# EasyEDA schematic 234trw_2020-09-26_01-09-06.json
TITLE: Sheet_1; REV: 1.0; Date: 2020-09-25; Sheet: 1/1; Drawn By: Christian Williams; Company: Your Company
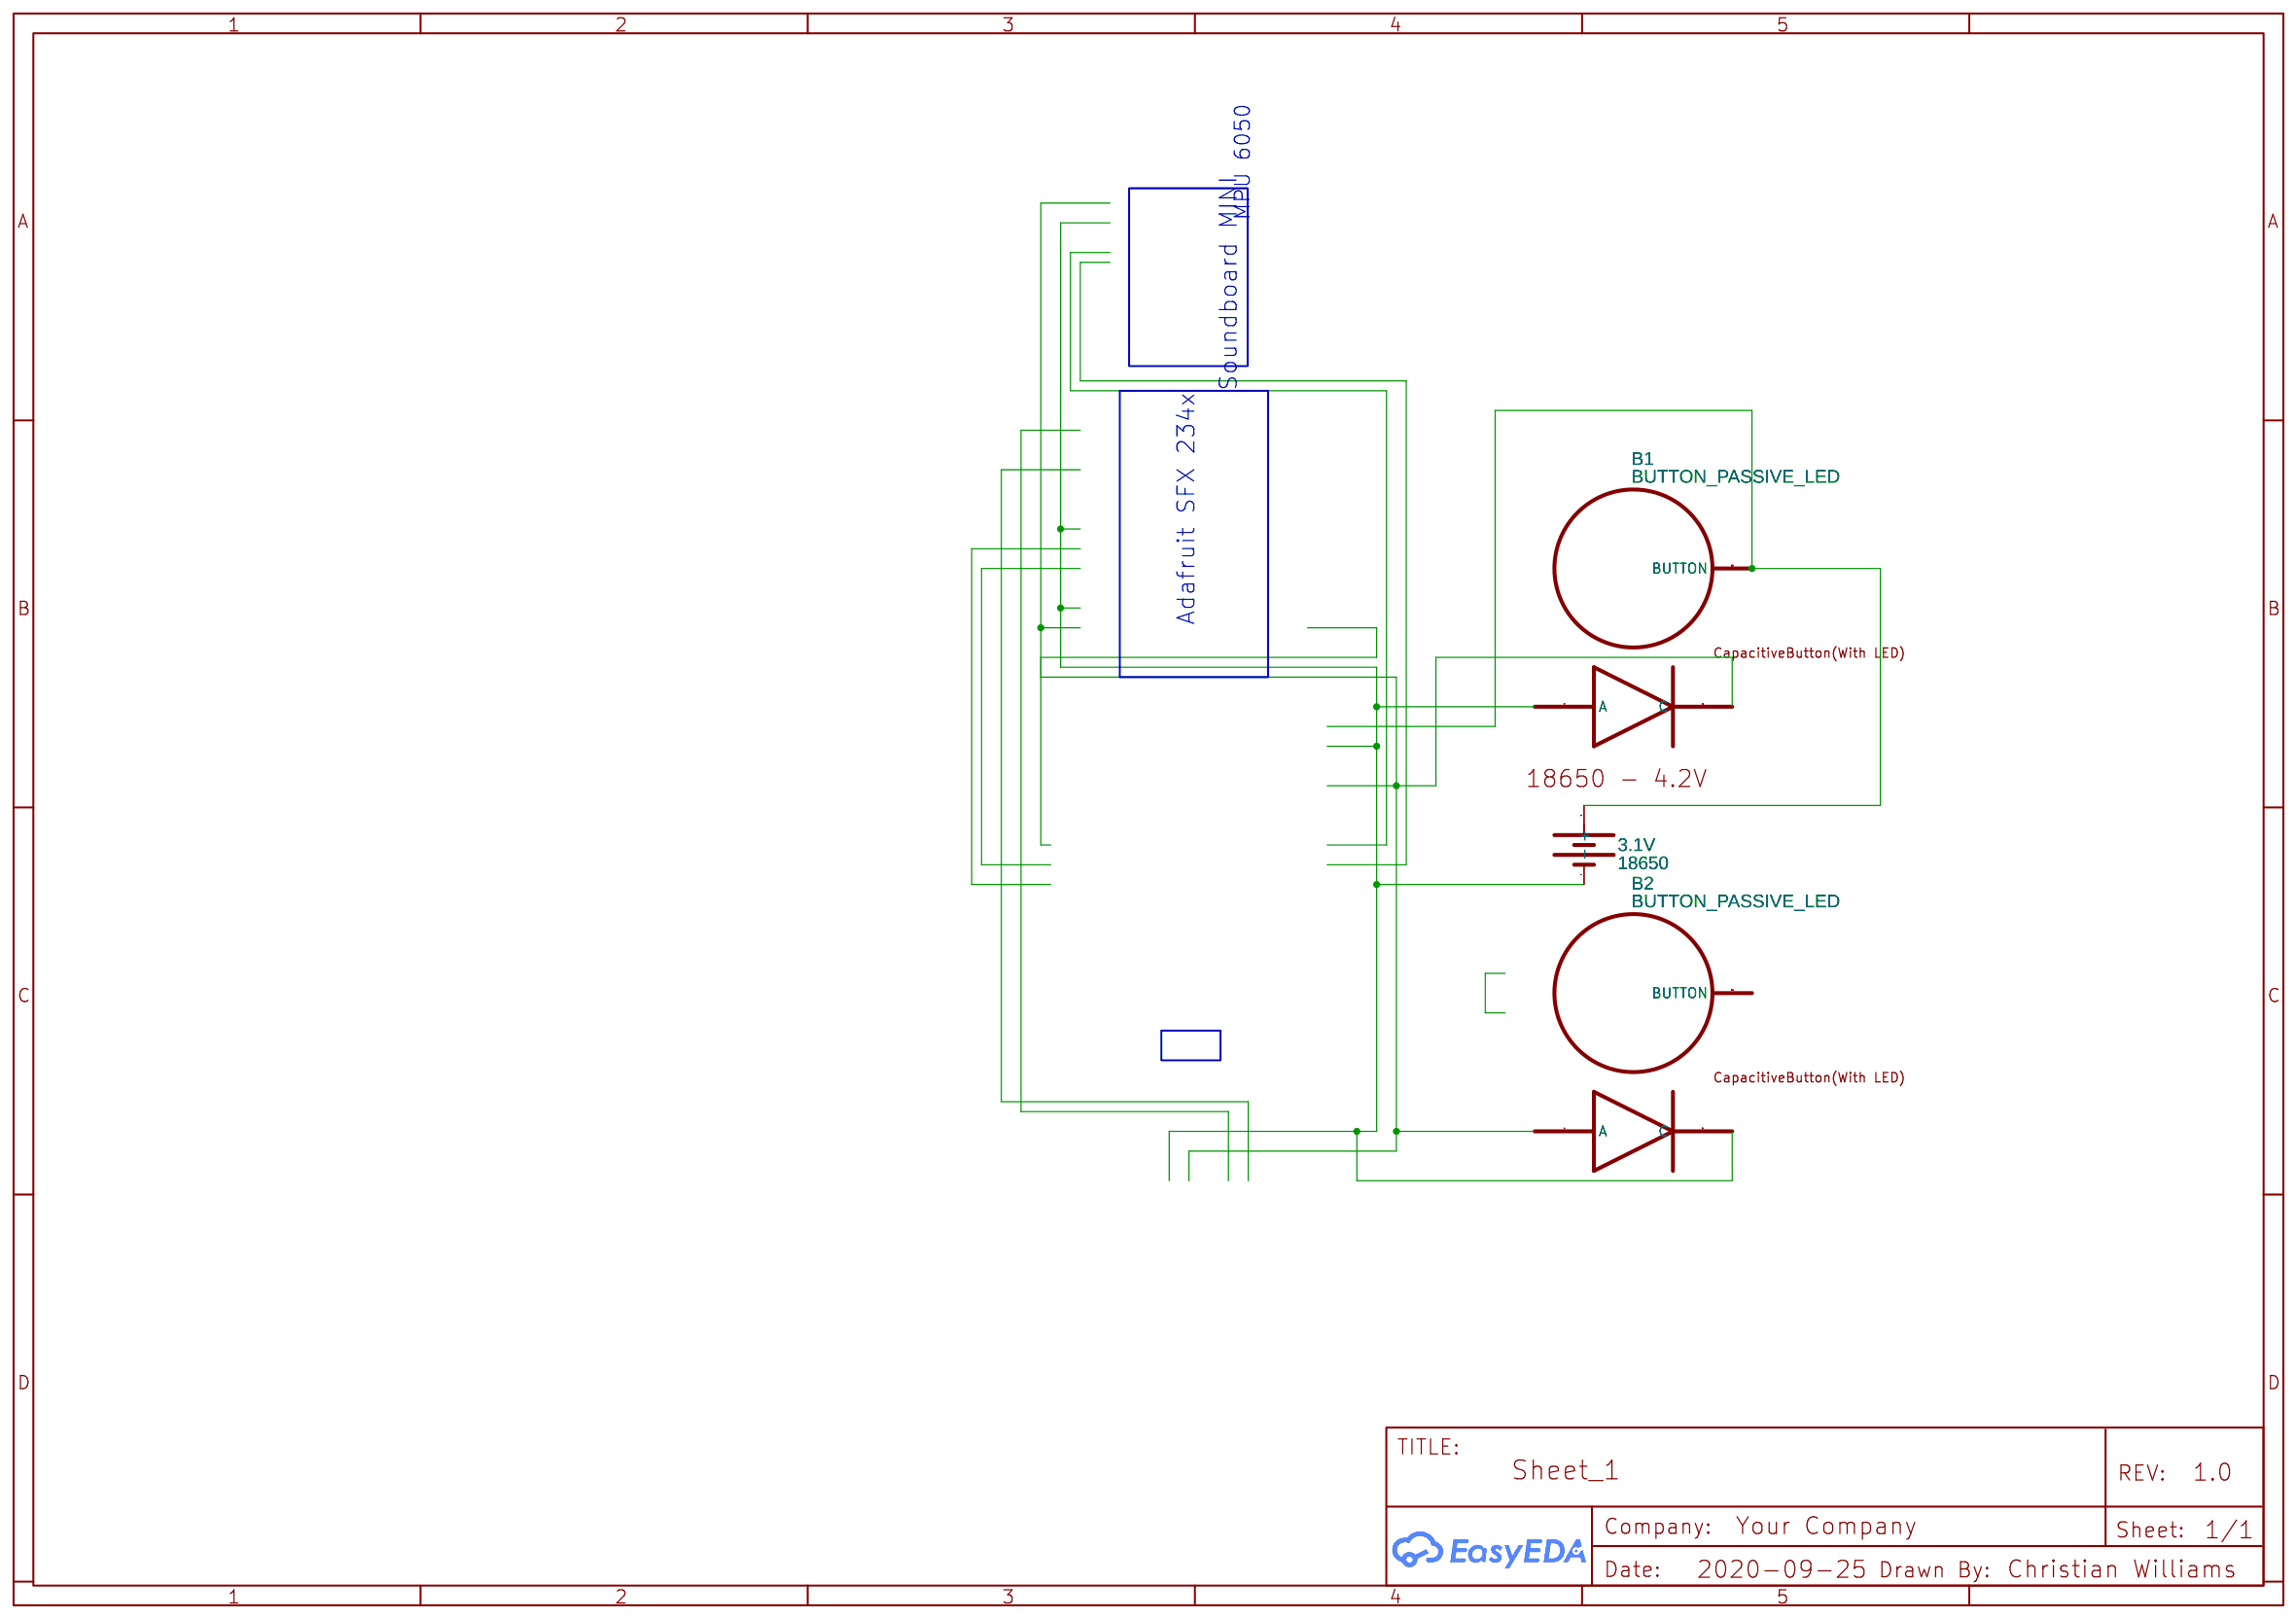
[diagram p0: schematic sheet]

## Parts
3.1V  18650  [18650-HOLDER]
B1  BUTTON_PASSIVE_LED  [BUTTON_PASSIVE_12MM_LED]
B2  BUTTON_PASSIVE_LED  [BUTTON_PASSIVE_12MM_LED]

## Library data of the parts
3.1V = 18650: Battery Holder; Contributor: SparkFun
B1 B2 = BUTTON_PASSIVE_LED: Button, Passive TouchCapacitive Sensing Type, with LED  Hole; Contributor: PatternAgents

## Nets
Net-(3.1V-+): 3.1V.+ B1.BUTTON
Net-(3.1V--): 3.1V.- B1.A B2.C
Net-(B1-C): B1.C B2.A

Not connected (* = marked no-connect by the designer): B2 BUTTON

## Notes on the sheet
- MPU 6050
- Soundboard MINI
- Adafruit SFX 234x
